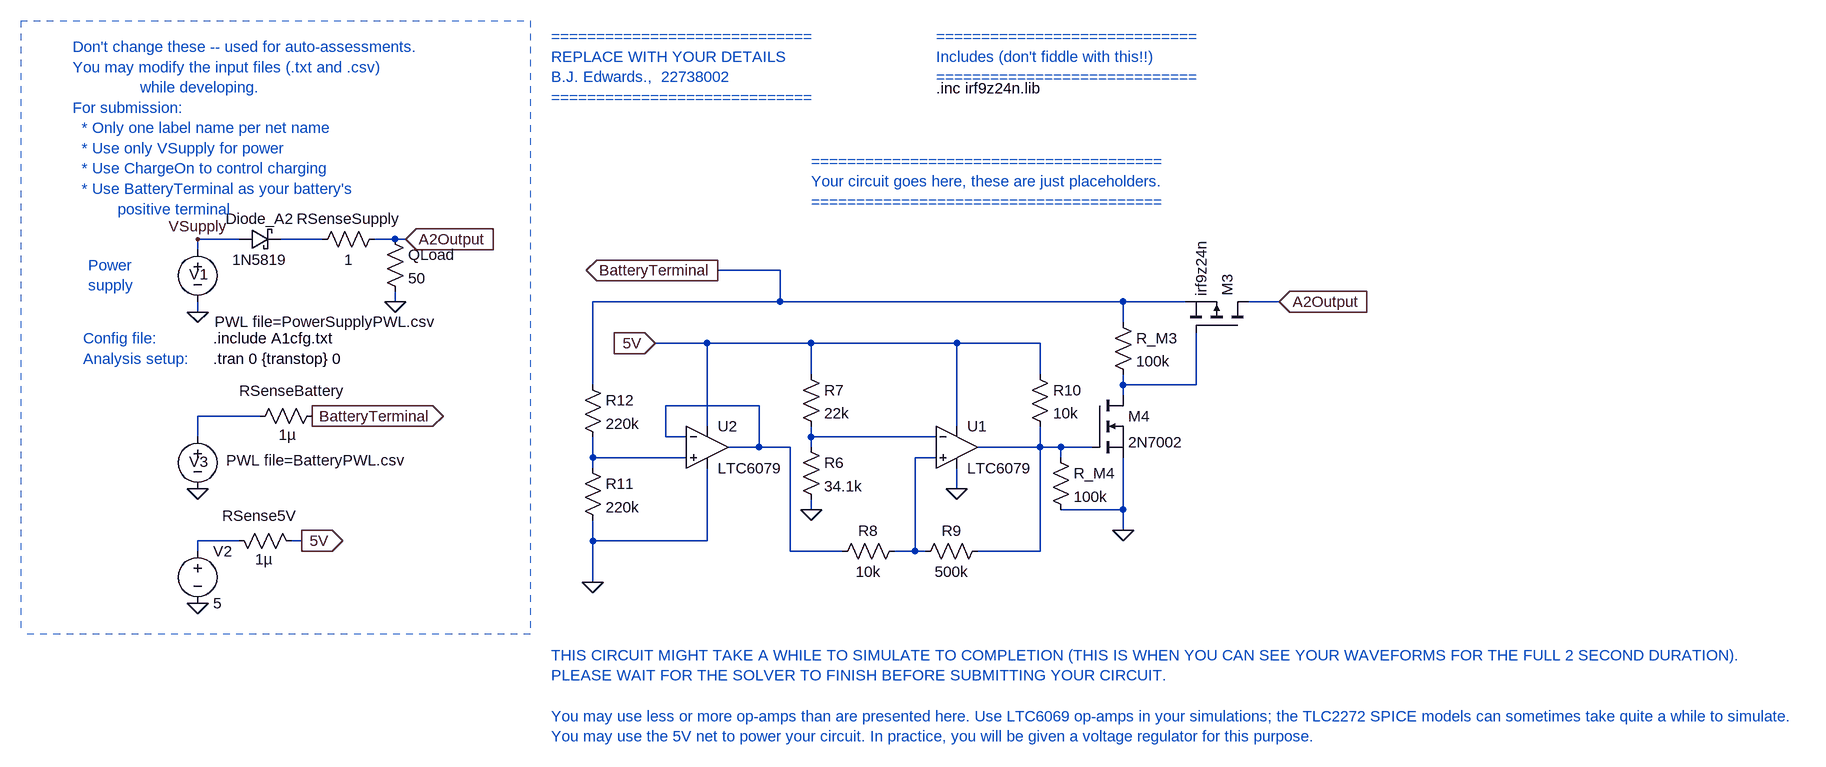
[diagram p0: schematic E344_22738002_A3.asc]
E344_22738002_A3.asc, the LTspice schematic file:
Version 4
SHEET 1 1824 680
WIRE -2032 -1088 -2096 -1088
WIRE -1904 -1088 -1968 -1088
WIRE -1792 -1088 -1824 -1088
WIRE -1776 -1088 -1792 -1088
WIRE -2096 -1072 -2096 -1088
WIRE -1200 -1040 -1296 -1040
WIRE -1792 -992 -1792 -1008
WIRE -1200 -992 -1200 -1040
WIRE -1200 -992 -1488 -992
WIRE -672 -992 -1200 -992
WIRE -576 -992 -672 -992
WIRE -432 -992 -480 -992
WIRE -2096 -976 -2096 -992
WIRE -672 -960 -672 -992
WIRE -1312 -928 -1392 -928
WIRE -1152 -928 -1312 -928
WIRE -928 -928 -1152 -928
WIRE -800 -928 -928 -928
WIRE -1152 -880 -1152 -928
WIRE -800 -880 -800 -928
WIRE -1488 -864 -1488 -992
WIRE -672 -864 -672 -880
WIRE -560 -864 -560 -944
WIRE -560 -864 -672 -864
WIRE -672 -848 -672 -864
WIRE -1232 -832 -1376 -832
WIRE -2000 -816 -2096 -816
WIRE -1312 -800 -1312 -928
WIRE -928 -800 -928 -928
WIRE -2096 -784 -2096 -816
WIRE -1376 -784 -1376 -832
WIRE -1344 -784 -1376 -784
WIRE -1152 -784 -1152 -800
WIRE -960 -784 -1152 -784
WIRE -1232 -768 -1232 -832
WIRE -1232 -768 -1280 -768
WIRE -1184 -768 -1232 -768
WIRE -1152 -768 -1152 -784
WIRE -800 -768 -800 -800
WIRE -800 -768 -896 -768
WIRE -768 -768 -800 -768
WIRE -720 -768 -768 -768
WIRE -1488 -752 -1488 -784
WIRE -1344 -752 -1488 -752
WIRE -960 -752 -992 -752
WIRE -768 -752 -768 -768
WIRE -1488 -736 -1488 -752
WIRE -928 -704 -928 -736
WIRE -1152 -672 -1152 -688
WIRE -672 -672 -672 -752
WIRE -672 -672 -768 -672
WIRE -672 -640 -672 -672
WIRE -2032 -624 -2096 -624
WIRE -1936 -624 -1952 -624
WIRE -1488 -624 -1488 -656
WIRE -1312 -624 -1312 -736
WIRE -1312 -624 -1488 -624
WIRE -2096 -608 -2096 -624
WIRE -1184 -608 -1184 -768
WIRE -1104 -608 -1184 -608
WIRE -992 -608 -992 -752
WIRE -992 -608 -1024 -608
WIRE -976 -608 -992 -608
WIRE -800 -608 -800 -768
WIRE -800 -608 -896 -608
WIRE -1488 -560 -1488 -624
FLAG -2096 -976 0
FLAG -1776 -1088 A2Output
IOPIN -1776 -1088 In
FLAG -1920 -816 BatteryTerminal
IOPIN -1920 -816 Out
FLAG -2096 -704 0
FLAG -1936 -624 5V
IOPIN -1936 -624 Out
FLAG -2096 -1088 VSupply
FLAG -1792 -992 0
FLAG -2096 -528 0
FLAG -1296 -1040 BatteryTerminal
IOPIN -1296 -1040 Out
FLAG -432 -992 A2Output
IOPIN -432 -992 In
FLAG -1392 -928 5V
IOPIN -1392 -928 In
FLAG -672 -640 0
FLAG -1152 -672 0
FLAG -928 -704 0
FLAG -1488 -560 0
SYMBOL voltage -2096 -1088 R0
WINDOW 123 0 0 Left 0
WINDOW 39 0 0 Left 0
WINDOW 3 26 127 Left 2
WINDOW 0 -13 54 Left 2
SYMATTR Value PWL file=PowerSupplyPWL.csv
SYMATTR InstName V1
SYMBOL res -1904 -832 R90
WINDOW 0 -7 47 VBottom 2
WINDOW 3 29 54 VTop 2
SYMATTR InstName RSenseBattery
SYMATTR Value 1µ
SYMBOL schottky -2032 -1072 R270
WINDOW 0 32 32 VTop 2
WINDOW 3 0 32 VBottom 2
SYMATTR InstName Diode_A2
SYMATTR Value 1N5819
SYMATTR Description Diode
SYMATTR Type diode
SYMBOL voltage -2096 -800 R0
WINDOW 123 0 0 Left 0
WINDOW 39 0 0 Left 0
WINDOW 3 44 52 Left 2
WINDOW 0 -13 54 Left 2
SYMATTR Value PWL file=BatteryPWL.csv
SYMATTR InstName V3
SYMBOL res -1920 -1072 R270
WINDOW 0 32 56 VTop 2
WINDOW 3 0 56 VBottom 2
SYMATTR InstName RSenseSupply
SYMATTR Value 1
SYMBOL res -1808 -1104 R0
SYMATTR InstName QLoad
SYMATTR Value 50
SYMBOL voltage -2096 -624 R0
WINDOW 123 0 0 Left 0
WINDOW 39 0 0 Left 0
SYMATTR InstName V2
SYMATTR Value 5
SYMBOL res -2048 -640 M90
WINDOW 0 -7 47 VBottom 2
WINDOW 3 29 54 VTop 2
SYMATTR InstName RSense5V
SYMATTR Value 1µ
SYMBOL pmos -480 -944 M270
SYMATTR InstName M3
SYMATTR Value irf9z24n
SYMATTR Prefix X
SYMATTR SpiceModel irf9z24n
SYMBOL nmos -720 -848 R0
SYMATTR InstName M4
SYMATTR Value 2N7002
SYMBOL OpAmps\\LTC6079 -928 -768 R0
SYMATTR InstName U1
SYMBOL res -688 -976 R0
SYMATTR InstName R_M3
SYMATTR Value 100k
SYMBOL res -784 -768 R0
SYMATTR InstName R_M4
SYMATTR Value 100k
SYMBOL res -1168 -784 R0
SYMATTR InstName R6
SYMATTR Value 34.1k
SYMBOL res -1168 -896 R0
SYMATTR InstName R7
SYMATTR Value 22k
SYMBOL res -1120 -592 R270
WINDOW 0 32 56 VTop 2
WINDOW 3 0 56 VBottom 2
SYMATTR InstName R8
SYMATTR Value 10k
SYMBOL res -992 -592 R270
WINDOW 0 32 56 VTop 2
WINDOW 3 0 56 VBottom 2
SYMATTR InstName R9
SYMATTR Value 500k
SYMBOL res -816 -896 R0
SYMATTR InstName R10
SYMATTR Value 10k
SYMBOL res -1504 -752 R0
SYMATTR InstName R11
SYMATTR Value 220k
SYMBOL res -1504 -880 R0
SYMATTR InstName R12
SYMATTR Value 220k
SYMBOL OpAmps\\LTC6079 -1312 -768 R0
SYMATTR InstName U2
TEXT -2072 -904 Left 2 !.tran 0 {transtop} 0
TEXT -2072 -936 Left 2 !.include A1cfg.txt
TEXT -2288 -1384 Left 2 ;Don't change these -- used for auto-assessments.\nYou may modify the input files (.txt and .csv) \n               while developing.\nFor submission: \n  * Only one label name per net name\n  * Use only VSupply for power\n  * Use ChargeOn to control charging\n  * Use BatteryTerminal as your battery's \n          positive terminal
TEXT -2272 -936 Left 2 ;Config file:
TEXT -2272 -904 Left 2 ;Analysis setup:
TEXT -2264 -1048 Left 2 ;Power\nsupply
TEXT -1552 -1400 Left 2 ;=============================\nREPLACE WITH YOUR DETAILS\nB.J. Edwards.,  22738002\n=============================
TEXT -960 -1320 Left 2 !.inc irf9z24n.lib
TEXT -960 -1400 Left 2 ;=============================\nIncludes (don't fiddle with this!!)\n=============================
TEXT -1152 -1208 Left 2 ;=======================================\nYour circuit goes here, these are just placeholders.\n=======================================
TEXT -1552 -448 Left 2 ;THIS CIRCUIT MIGHT TAKE A WHILE TO SIMULATE TO COMPLETION (THIS IS WHEN YOU CAN SEE YOUR WAVEFORMS FOR THE FULL 2 SECOND DURATION).\nPLEASE WAIT FOR THE SOLVER TO FINISH BEFORE SUBMITTING YOUR CIRCUIT.\n \nYou may use less or more op-amps than are presented here. Use LTC6069 op-amps in your simulations; the TLC2272 SPICE models can sometimes take quite a while to simulate.\nYou may use the 5V net to power your circuit. In practice, you will be given a voltage regulator for this purpose.
LINE Normal -1584 -1424 -1584 -480 2
LINE Normal -2368 -1424 -1584 -1424 2
LINE Normal -1584 -480 -2368 -480 2
LINE Normal -1584 -496 -1584 -496 2
LINE Normal -2368 -1424 -2368 -480 2

The netlist it stands for:
* E344_22738002_A3.asc
V1 VSupply 0 PWL file=PowerSupplyPWL.csv
RSenseBattery BatteryTerminal N004 1µ
Diode_A2 VSupply N001 1N5819
V3 N004 0 PWL file=BatteryPWL.csv
RSenseSupply N001 A2Output 1
R§QLoad A2Output 0 50
V2 N009 0 5
RSense5V N009 5V 1µ
XM3 A2Output N002 BatteryTerminal irf9z24n irf9z24n  ; pins D G S
M4 N002 N006 0 0 2N7002
XU1 N008 N005 5V 0 N006 LTC6078  ; LTC6079, pins In+ In- V+ V- OUT
R_M3 BatteryTerminal N002 100k
R_M4 N006 0 100k
R6 N005 0 34.1k
R7 5V N005 22k
R8 N003 N008 10k
R9 N008 N006 500k
R10 5V N006 10k
R11 N007 0 220k
R12 BatteryTerminal N007 220k
XU2 N007 N003 5V 0 N003 LTC6078  ; LTC6079, pins In+ In- V+ V- OUT
.model D D
.lib standard.dio
.model NMOS NMOS
.model PMOS PMOS
.lib standard.mos
.tran 0 {transtop} 0
.include A1cfg.txt
* Don't change these -- used for auto-assessments.
* You may modify the input files (.txt and .csv)
*                while developing.
* For submission:
*   * Only one label name per net name
*   * Use only VSupply for power
*   * Use ChargeOn to control charging
*   * Use BatteryTerminal as your battery's
*           positive terminal
* Config file:
* Analysis setup:
* Power
* supply
* =============================
* REPLACE WITH YOUR DETAILS
* B.J. Edwards.,  22738002
* =============================
.inc irf9z24n.lib
* =============================
* Includes (don't fiddle with this!!)
* =============================
* =======================================
* Your circuit goes here, these are just placeholders.
* =======================================
* THIS CIRCUIT MIGHT TAKE A WHILE TO SIMULATE TO COMPLETION (THIS IS WHEN YOU CAN SEE YOUR WAVEFORMS FOR THE FULL 2 SECOND DURATION).
* PLEASE WAIT FOR THE SOLVER TO FINISH BEFORE SUBMITTING YOUR CIRCUIT.
* You may use less or more op-amps than are presented here. Use LTC6069 op-amps in your simulations; the TLC2272 SPICE models can sometimes take quite a while to simulate.
* You may use the 5V net to power your circuit. In practice, you will be given a voltage regulator for this purpose.
.lib LTC5.lib
.backanno
.end